# EAGLE design usbhub (EAGLE 7.5.0)
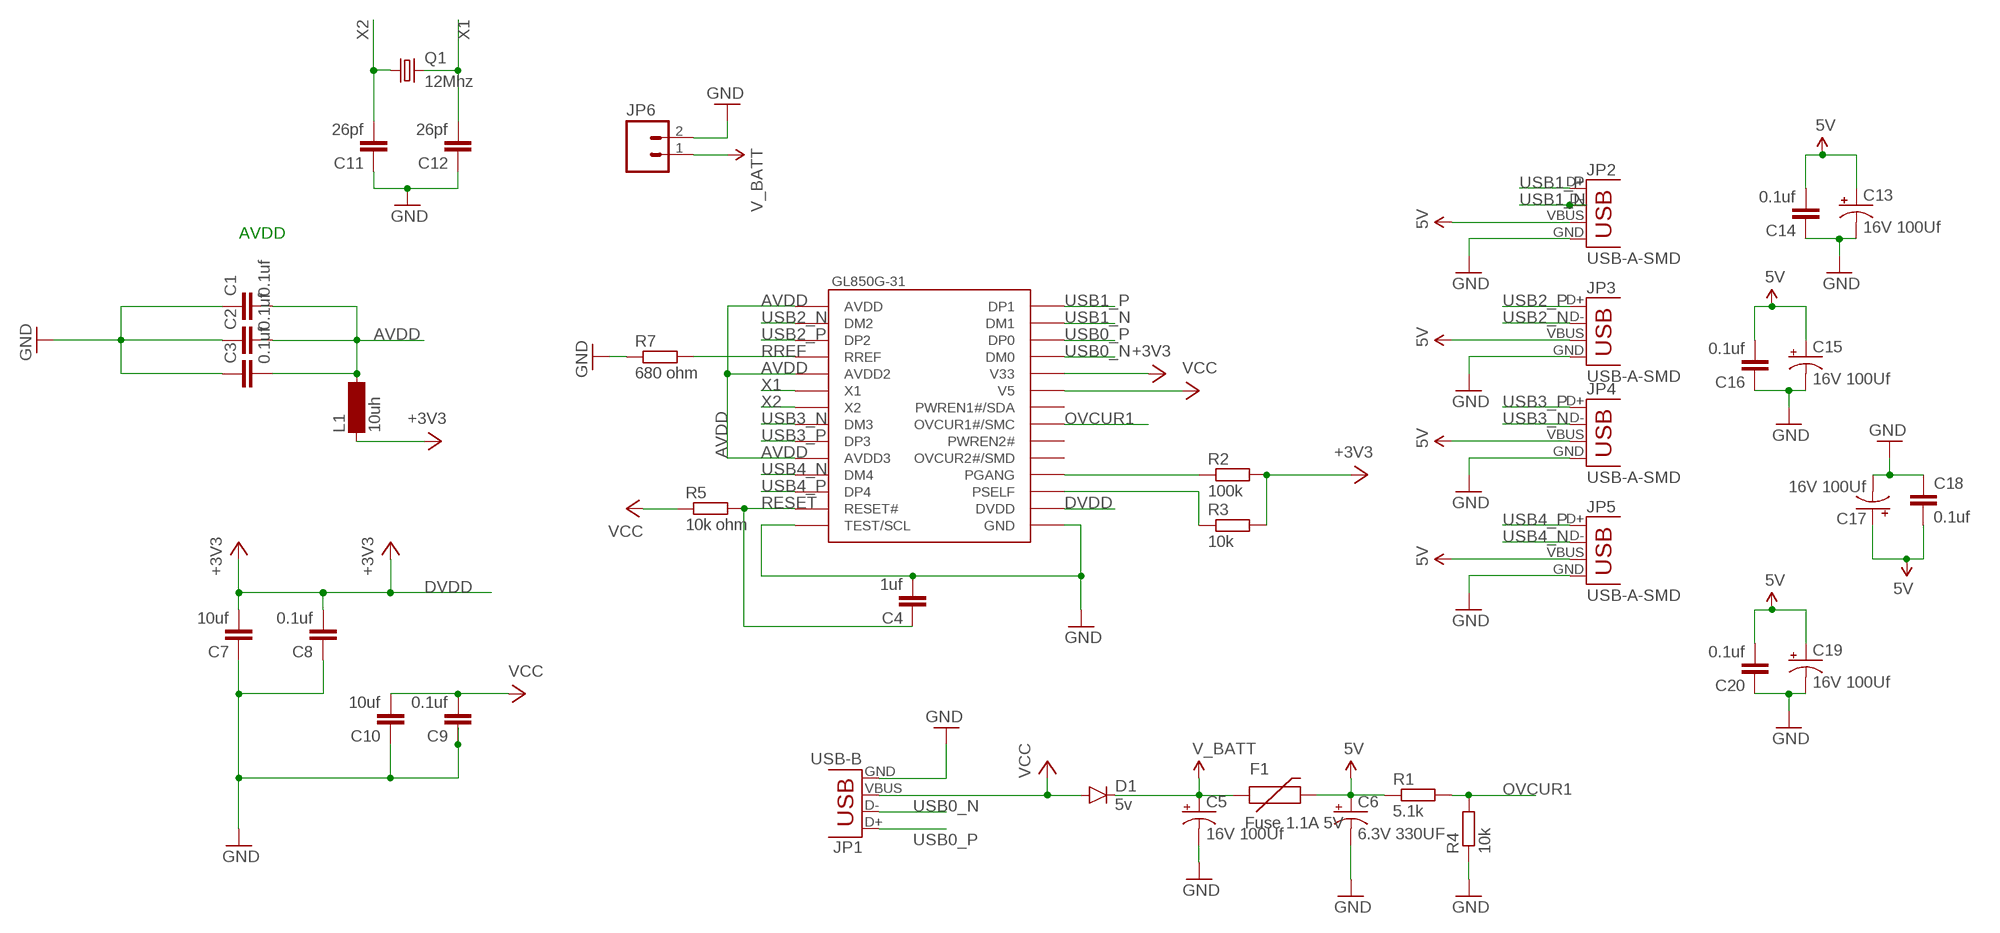
[diagram p0: schematic, sheet 1]

## Parts
C1  0.1uf  C-EUC1206  [C1206]
C2  0.1uf  C-EUC1206  [C1206]
C3  0.1uf  C-EUC1206  [C1206]
C4  1uf  C-EUC1206  [C1206]
C5  16V 100Uf  CAP_POLD  [PANASONIC_D]
C6  6.3V 330UF  CAP_POLD  [PANASONIC_D]
C7  10uf  C-EUC1206  [C1206]
C8  0.1uf  C-EUC1206  [C1206]
C9  0.1uf  C-EUC1206  [C1206]
C10  10uf  C-EUC1206  [C1206]
C11  26pf  C-EUC1206  [C1206]
C12  26pf  C-EUC1206  [C1206]
C13  16V 100Uf  CAP_POLD  [PANASONIC_D]
C14  0.1uf  C-EUC1206  [C1206]
C15  16V 100Uf  CAP_POLD  [PANASONIC_D]
C16  0.1uf  C-EUC1206  [C1206]
C17  16V 100Uf  CAP_POLD  [PANASONIC_D]
C18  0.1uf  C-EUC1206  [C1206]
C19  16V 100Uf  CAP_POLD  [PANASONIC_D]
C20  0.1uf  C-EUC1206  [C1206]
D1  5v  DIODESMA-ALT  [SMA-DIODE_ALT]
F1  Fuse 1.1A 5V  PTCSMD  [PTC-1206]
JP1  USB-B  USBPTH  [USB-B-PTH]
JP2  USB-A-SMD  [USB-A-S-NOSILK-FEMALE]
JP3  USB-A-SMD  [USB-A-S-NOSILK-FEMALE]
JP4  USB-A-SMD  [USB-A-S-NOSILK-FEMALE]
JP5  USB-A-SMD  [USB-A-S-NOSILK-FEMALE]
JP6  M02LOCK_LONGPADS  [1X02_LOCK_LONGPADS]
L1  10uh  SM-1206  [SM-1206]
Q1  12Mhz  CRYSTALCTS406  [CTS406]
R1  5.1k  R-EU_M1206  [M1206]
R2  100k  R-EU_M1206  [M1206]
R3  10k  R-EU_M1206  [M1206]
R4  10k  R-EU_M1206  [M1206]
R5  10k ohm  R-EU_M1206  [M1206]
R7  680 ohm  R-EU_M1206  [M1206]
U$1  GL850G-31  [TSSOP28]

## Nets
5V: C6.+ C13.+ C14.2 C15.+ C16.2 C17.+ C18.2 C19.+ C20.2 F1.2 JP2.VBUS JP3.VBUS JP4.VBUS JP5.VBUS R1.1
+3V3: L1.1 R2.2 R3.2 U$1.24(V33)
AVDD: C1.2 C2.2 C3.2 L1.2 U$1.1(AVDD) U$1.5(AVDD2) U$1.10(AVDD3)
DVDD: C7.2 C8.2 U$1.16(DVDD) ; supply symbol labelled +3V3
GND: C1.1 C2.1 C3.1 C4.2 C5.- C6.- C7.1 C8.1 C9.1 C10.1 C11.1 C12.1 C13.- C14.1 C15.- C16.1 C17.- C18.1 C19.- C20.1 JP1.GND JP2.GND JP3.GND JP4.GND JP5.GND JP6.2 R4.1 R7.1 U$1.14(TEST/SCL) U$1.15(GND)
N$2: R2.1 U$1.18(PGANG)
N$4: R3.1 U$1.17(PSELF)
OVCUR1: R1.2 R4.2 U$1.21(OVCUR1#/SMC)
RESET: C4.1 R5.2 U$1.13(RESET#)
RREF: R7.2 U$1.4(RREF)
USB0_N: JP1.D- U$1.25(DM0)
USB0_P: JP1.D+ U$1.26(DP0)
USB1_N: JP2.D- U$1.27(DM1)
USB1_P: JP2.D+ U$1.28(DP1)
USB2_N: JP3.D- U$1.2(DM2)
USB2_P: JP3.D+ U$1.3(DP2)
USB3_N: JP4.D- U$1.8(DM3)
USB3_P: JP4.D+ U$1.9(DP3)
USB4_N: JP5.D- U$1.11(DM4)
USB4_P: JP5.D+ U$1.12(DP4)
V_BATT: C5.+ D1.C F1.1 JP6.1
VCC: C9.2 C10.2 D1.A JP1.VBUS R5.1 U$1.23(V5)
X1: C12.2 Q1.3 U$1.6(X1)
X2: C11.2 Q1.1 U$1.7(X2)
Unconnected: U$1.19(OVCUR2#/SMD) U$1.20(PWREN2#) U$1.22(PWREN1#/SDA)

## Notes on the sheet
- AVDD

## Library data of the parts
C1-C3 C8 C9 C14 C16 C18 C20 = rcl:C-EU: CAPACITOR, European symbol; MF: MULTICOMP; MPN: MCSH31B104K500CT; OC_FARNELL: 1856626
C4 = rcl:C-EU: CAPACITOR, European symbol; MF: AVX; MPN: 12061C105KAT2A; OC_FARNELL: 1657939
C5 C13 C15 C17 C19 = SparkFun-Passives:CAP_POL: Capacitor Polarized These are standard SMD and PTH capacitors. Normally 10uF, 47uF, and 100uF in electrolytic and tantalum varieties. Always verify the external diameter of the through hole cap, it varies with capacity, voltage, and manufacturer. The EIA devices should be standard.; MF: PANASONIC ELECTRONIC COMPONENTS; MPN: EEEHA1C101WP; OC_FARNELL: 1973308
C6 = SparkFun-Passives:CAP_POL: Capacitor Polarized These are standard SMD and PTH capacitors. Normally 10uF, 47uF, and 100uF in electrolytic and tantalum varieties. Always verify the external diameter of the through hole cap, it varies with capacity, voltage, and manufacturer. The EIA devices should be standard.; MF: PANASONIC ELECTRONIC COMPONENTS; MPN: EEEHC0J331P; OC_FARNELL: 1714688
C7 C10 = rcl:C-EU: CAPACITOR, European symbol; MF: KEMET; MPN: C1206C106K3PACTU; OC_FARNELL: 1288206
C11 C12 = rcl:C-EU: CAPACITOR, European symbol; MF: AVX; MPN: 12061A220JAT2A; OC_FARNELL: 499249
D1 = SparkFun-DiscreteSemi:DIODE: Diode These are standard reverse protection diodes and small signal diodes. SMA package can handle up to about 1A. SOD-323 can handle about 200mA. What the SOD-323 package when ordering, there are some mfgs out there that are 5-pin packages.; MF: LITTELFUSE; MPN: SMAJ5.0A; OC_FARNELL: 1827607
F1 = SparkFun-PowerIC:PTC: Resettable Fuse PTC Resettable Fuse. Spark Fun Electronics SKU : COM-08357; MF: TE CONNECTIVITY / RAYCHEM; MPN: MICROSMD110F-2; OC_FARNELL: 1345920; PROD_ID: RES-11150
JP1 = SparkFun-Connectors:USB: USB Connectors USB-B-PTH is fully proven SKU : PRT-00139/CONN-08278 USB-miniB is fully proven SKU : PRT-00587 USB-A-PCB is untested. USB-A-H is throughly reviewed, but untested. Spark Fun Electronics SKU : PRT-00437 USB-B-SMT is throughly reviewed, but untested. Needs silkscreen touching up. USB-A-S has not been used/tested USB-MB-H has not been used/tested USB-MICROB has been used. CONN-09505; MF: TE CONNECTIVITY / AMP; MPN: 292304-1; OC_FARNELL: 1076665; PROD_ID: CONN-08278
JP2-JP5 = SparkFun-Connectors:USB: USB Connectors USB-B-PTH is fully proven SKU : PRT-00139/CONN-08278 USB-miniB is fully proven SKU : PRT-00587 USB-A-PCB is untested. USB-A-H is throughly reviewed, but untested. Spark Fun Electronics SKU : PRT-00437 USB-B-SMT is throughly reviewed, but untested. Needs silkscreen touching up. USB-A-S has not been used/tested USB-MB-H has not been used/tested USB-MICROB has been used. CONN-09505; OC_FARNELL: unknown; PROD_ID: CONN-09520
JP6 = SparkFun-Connectors:M02: Standard 2-pin 0.1" header. Use with - straight break away headers ( PRT-00116) - right angle break away headers (PRT-00553) - swiss pins (PRT-00743) - machine pins (PRT-00117) - female headers (PRT-00115) Molex polarized connector foot print use with: PRT-08233 with associated crimp pins and housings. 2.54_SCREWTERM for use with PRT-10571. 3.5mm Screw Terminal footprints for PRT-08084 5mm Screw Terminal footprints for use with PRT-08432; OC_FARNELL: unknown
L1 = inductor-neosid:SM-1206: INDUCTOR SMD chip inductor; MF: COILCRAFT; MPN: PFL3215-103MEB; OC_FARNELL: 2288772; OC_NEWARK: unknown
Q1 = crystal:CRYSTAL: CRYSTAL; MF: ABRACON; MPN: ABM3B-12.000MHZ-B2-T; OC_FARNELL: 1611810; OC_NEWARK: unknown
R1 = rcl:R-EU_: RESISTOR, European symbol; MF: VISHAY; MPN: CRCW12065K10FKEA.; OC_FARNELL: 2139485
R2 = rcl:R-EU_: RESISTOR, European symbol; MF: WELWYN; MPN: WCR1206-100KFI; OC_FARNELL: 1100244
R3-R5 = rcl:R-EU_: RESISTOR, European symbol; MF: MULTICOMP; MPN: MCMR12X1002FTL; OC_FARNELL: 2073878
R7 = rcl:R-EU_: RESISTOR, European symbol; MF: WELWYN; MPN: WCR1206-680RFI; OC_FARNELL: 1100187
U$1 = pimoroni:GL850G-31; OC_FARNELL: unknown

## Board
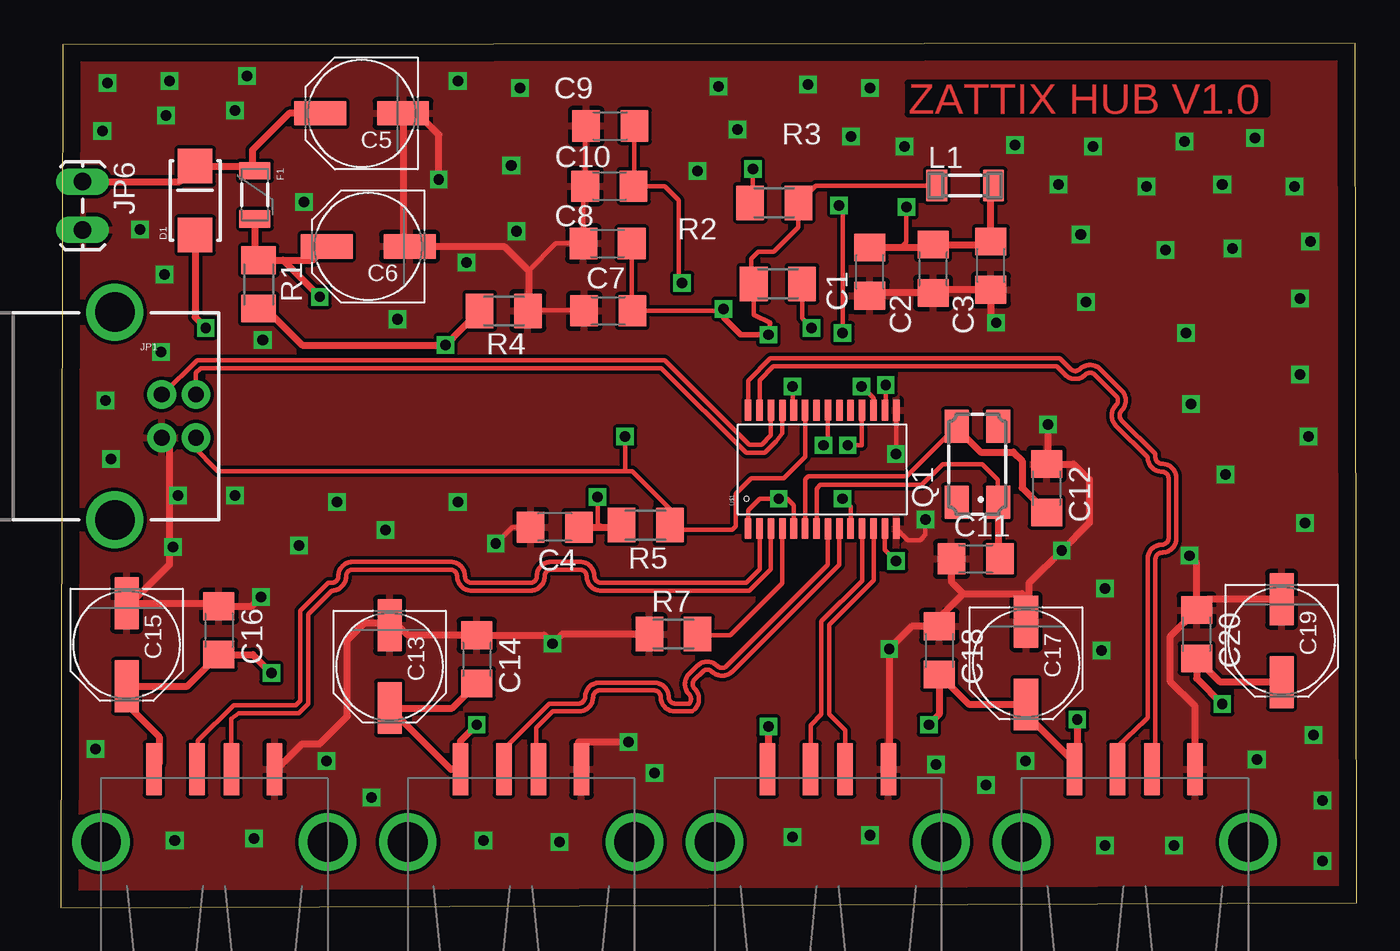
[diagram p1: board, top side]
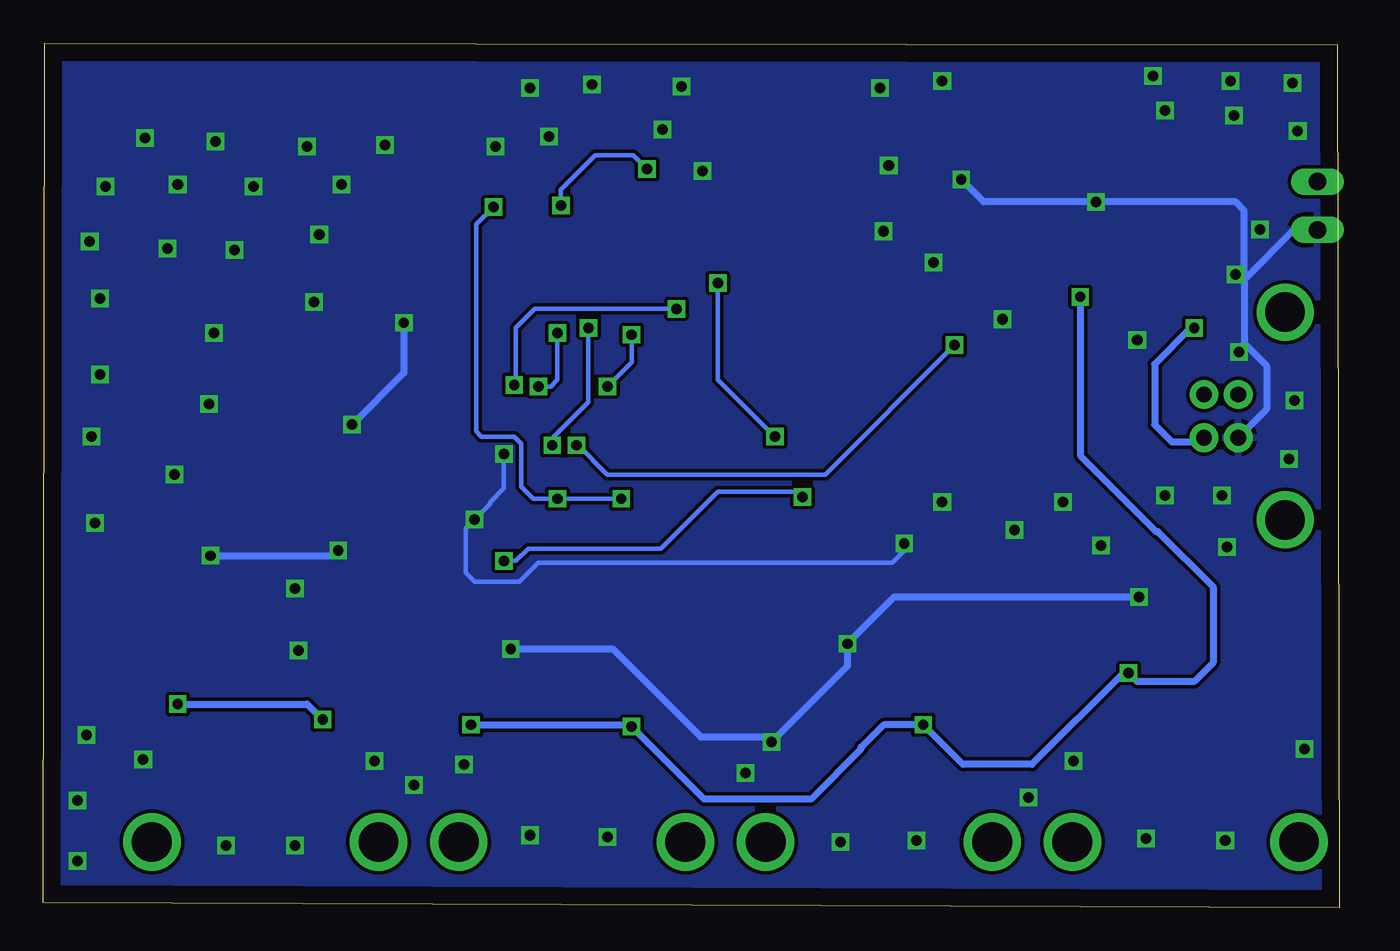
[diagram p2: board, bottom side, seen from below]

Size 75.1 x 50.1 mm. Coordinates in mm from the lower left corner, seen from the top.
Outline: 0,0 75.1,0.3 75,50.1 0.1,50 0,0
Copper layers (1*16): Top 0.035mm / dielectric 1.5mm / Bottom 0.035mm
Design rules "default": minimum track width 10mil, minimum drill 24mil, track to track 8mil, track to pad 8mil, pad to pad 8mil, via to via 8mil, smd to smd 8mil, copper to edge 40mil, drill to drill 8mil, minimum pad ring 10mil, minimum via ring 8mil, stop-mask expansion 4mil, vias tented up to drill 0mil, thermal gap 10mil

### Footprints (pad centres in the part's own frame; a part is rotated, then mirrored left to right if it is on the bottom)
C1206 = smd 1.6 x 1.8: 1 -1.4,0; 2 1.4,0
PANASONIC_D = smd 3 x 1.4: + 2.4,0; - -2.4,0
SMA-DIODE_ALT = smd 2 x 2: A -2,0; C 2,0
PTC-1206 = smd 1 x 1.8: 1 -1.4,0; 2 1.4,0
USB-B-PTH = drill 0.914 pad 1.676: D+ 0,1.25; D- 1.981,1.25; GND 0,-1.25; VBUS 1.981,-1.25 | drill 2.286: S1 -2.718,-6.02; S2 -2.718,6.02
USB-A-S-NOSILK-FEMALE = smd 3 x 0.9: D+ 4.212,-1; D- 4.212,1; GND 4.212,-3.5; VBUS 4.212,3.5 | drill 2.311: S1 0,-6.566; S2 0,6.566
1X02_LOCK_LONGPADS = drill 1.016 long: 1 -0.127,0; 2 2.667,0
SM-1206 = smd 1.2 x 1.8: 1 -1.65,0; 2 1.65,0
CTS406 = smd 1.9 x 1.4: 1 -2.2,-1.2; 2 2.2,-1.2; 3 2.2,1.2; 4 -2.2,1.2
M1206 = smd 1.6 x 2: 1 -1.4,0; 2 1.4,0
TSSOP28 = smd 1.2 x 0.38: 1 -3.429,4.623; 2 -3.429,3.962; 3 -3.429,3.302; 4 -3.429,2.642; 5 -3.429,1.981; 6 -3.429,1.321; 7 -3.429,0.66; 8 -3.435,0; 9 -3.429,-0.66; 10 -3.429,-1.321; 11 -3.429,-1.981; 12 -3.429,-2.642; 13 -3.429,-3.302; 14 -3.429,-3.962; 15 3.429,-3.962; 16 3.429,-3.302; 17 3.429,-2.642; 18 3.429,-1.981; 19 3.429,-1.321; 20 3.429,-0.66; 21 3.435,0; 22 3.429,0.66; 23 3.429,1.321; 24 3.429,1.981; 25 3.429,2.642; 26 3.429,3.302; 27 3.429,3.962; 28 3.429,4.623

### Placement (x,y rotation side)
C1  46.88,36.86 90 top
C2  50.55,37.03 90 top
C3  53.89,37.21 90 top
C4  28.62,22.06 180 top
C5  17.43,46.03 180 top
C6  17.81,38.32 180 top
C7  31.72,34.59 0 top
C8  31.68,38.49 0 top
C9  31.84,45.3 0 top
C10  31.79,41.82 0 top
C11  53.01,20.22 0 top
C12  57.12,24.31 270 top
C13  19.05,13.97 270 top
C14  24.1,14.39 270 top
C15  3.81,15.24 270 top
C16  9.16,16.07 270 top
C17  55.93,14.17 270 top
C18  50.9,14.91 270 top
C19  70.74,15.47 270 top
C20  65.81,15.85 270 top
D1  7.78,40.98 90 top
F1  11.24,41.31 270 top
JP1  5.85,28.49 0 top
JP2  62.23,3.81 90 top
JP3  8.89,3.81 90 top
JP4  26.67,3.81 90 top
JP5  44.45,3.81 90 top
JP6  1.26,41.95 270 top
L1  52.4,41.85 0 top
Q1  53.11,25.7 90 top
R1  11.46,36.12 270 top
R2  41.55,36.15 180 top
R3  41.34,40.84 0 top
R4  25.67,34.58 180 top
R5  33.89,22.17 180 top
R7  35.5,15.86 0 top
U$1  44.45,25.4 90 top

### Tracks (layer width: path | path; a pad name or v marks a point on that pad's centre or on a via)
5V  (via drill 0.6)
  Top 0.406: C17.+ 55.4,11.77 | 55.4,11.77 52.64,11.77 C18.2 50.9,11.2 v50.3,10.6 | C19.+ 67.19,13.07 C20.2 65.81,13.29 v67.3,11.8 | v58.9,10.9 58.9,8.19 JP2.VBUS 58.73,8.44 55.4,11.77 | C14.2 22.68,11.57 C13.+ 22.6,8.02 JP4.VBUS 23.17,9.67 v24.1,10.6 | v41,10.5 41,8.07 JP5.VBUS | JP3.VBUS 5.7,8.33 5.7,9.9 3.81,11.79 C15.+ 7.33,12.84 C16.2 11.13,14.67 v12.2,13.6 | F1.2 11.24,37.74 R1.1 | R1.1 14.61,37.52 C6.+ | R1.1 12.88,37.52 v15,35.4
  Bottom 0.406: v67.3,11.8 59.8,11.8 v58.9,10.9 | v50.3,10.6 41.1,10.6 v41,10.5 36.8,6.3 30.6,6.3 27.7,9.2 27.7,9.3 26.4,10.6 v24.1,10.6 21.8,8.3 17.8,8.3 12.5,13.6 v12.2,13.6 11.7,13.1 8.4,13.1 7.3,14.2 7.3,18.6 10.5,21.8 10.6,21.8 15,26.2 v15,35.4
+3V3  (via drill 0.6)
  Top 0.254: L1.1 43.75,41.85 R3.2 42.74,39.44 41.3,38 40.4,38 40,37.6 40,36.3 R2.2 40.15,34.35 41.1,33.9 v41,33.2 | v42.4,30.2 42.4,28.9 U$1.24
  Bottom 0.254: v41,33.2 41,31.6 v42.4,30.2
AVDD  (via drill 0.6)
  Top 0.254: U$1.1 39.83,23.03 40.5,23.7 v41.6,23.7 42.1,23.7 42.47,23.33 U$1.5 | U$1.10 45.77,23.23 v45.3,23.7 | v49,40.6 49,38.56 48.7,38.26
  Top 0.406: C1.2 48.7,38.26 50.38,38.26 C2.2 53.71,38.43 C3.2 53.89,41.69 L1.2
  Bottom 0.254: v41.6,23.7 v45.3,23.7 46.7,23.7 47.4,24.4 47.4,26.9 47.8,27.3 49.7,27.3 50,27.6 50,39.6 v49,40.6
DVDD  (via drill 0.6)
  Top 0.254: v38.4,34.7 38.29,34.59 C7.2 33.08,34.63 C8.2 | v47.8,30.3 47.8,28.88 U$1.16
  Top 0.305: v38.4,34.7 38.4,34.2 39.4,33.2 41.1,33.2
  Bottom 0.254: v38.4,34.7 46.6,34.7 47.7,33.6 47.7,30.4 v47.8,30.3
GND  (via drill 0.6, 0.61)
  Top 0.254: 27.1,34.61 30.3,34.61 C7.1 | 27.1,36.9 28.69,38.49 C8.1 30.28,41.71 C10.1 30.39,45.25 C9.1 | U$1.15 48.41,26.31 v48.4,26.3 | v50.1,22.5 50.1,21.6 49.8,21.3 49.08,21.3 U$1.14 | C4.2 26.16,22.06 v25.2,21.1
  Top 0.406: 56.1,17.8 56.1,18.8 v58,20.7 59.6,22.3 59.6,24.8 58.69,25.71 C12.1 57.2,25.79 v57.2,28 | 56.1,17.8 56.1,16.74 C17.- | C11.1 51.61,18.89 52.3,18.2 | 52.3,18.2 55.7,18.2 56.1,17.8 | 52.3,18.2 50.9,16.8 C18.1 49.31,16.31 v48,15 48,8.07 JP5.GND | C19.- 66.43,17.87 C20.1 | JP2.GND 65.73,11.67 64.3,13.1 64.3,15.74 C20.1 | v32.9,9.6 30,9.6 30,8.19 JP4.GND | JP3.GND 12.52,8.02 14,9.5 15,9.5 16.6,11.1 16.6,15.5 17.6,16.5 18.5,16.5 19.2,15.8 19.2,16.22 C13.- 19,16.42 19,16.9 20.11,15.79 C14.1 28.01,15.79 v28.5,15.3 29.06,15.86 | v11.6,18 11.07,17.47 C16.1 8.99,17.64 C15.- 4.04,17.64 6.3,19.9 6.3,26.79 JP1.GND | R4.1 27.1,34.61 27.1,36.9 25.68,38.32 C6.- 19.83,38.7 C5.- 20.16,45.7 21,45.7 21.9,44.8 v21.9,42.2 | C20.1 65.81,19.99 v65.4,20.4 | 29.06,15.86 R7.1 29.06,15.86 | C1.1 47.05,35.63 C2.1 50.73,35.81 C3.1 53.89,34.21 v54.2,33.9
  Bottom 0.254: v48.4,26.3 48.4,24.3 49.2,23.5 49.2,23.4 v50.1,22.5 50.6,22 50.6,19.4 50.1,18.9 47.5,18.9 46.4,20 25.9,20 25.2,20.7 v25.2,21.1
  Bottom 0.406: v11.6,18 25.8,18 v28.5,15.3 28.5,14 v32.9,9.6 33.2,9.9 37,9.9 42.1,15 v48,15 | JP6.2 2.62,39.28 5.5,36.4 | 5.5,36.4 5.5,32.7 4.2,31.4 4.2,28.89 JP1.GND | 5.5,36.4 5.5,40.4 6,40.9 20.6,40.9 v21.9,42.2 | v65.4,20.4 58.3,20.4 v58,20.7 | v54.2,33.9 54.2,31 v57.2,28
  other vias: 2,9.2 6.6,3.9 11.2,4 15.4,8.5 18,6.4 24.5,3.9 28.9,3.8 34.4,7.8 42.4,4.1 46.9,4.2 50.7,8.3 53.6,7.1 55.9,8.5 60.5,3.6 64.5,3.6 73.1,2.7 73.1,6.2 69.3,8.6 72.6,10 60.3,14.9 60.5,18.5 72.1,22.3 67.5,25.1 72.3,27.3 65.5,29.2 71.8,30.9 65.2,33.3 59.4,35.1 67.9,38.2 71.8,35.3 64,38.1 59.1,39 57.8,41.9 62.9,41.8 67.3,41.9 71.5,41.8 72.4,38.6 69.2,44.6 65.1,44.4 59.8,44.1 55.3,44.2 48.9,44.1 46.9,47.5 45.8,44.7 43.3,47.7 39.2,45.1 38.1,47.6 36.9,42.7 26.6,47.5 26.1,43 23,47.9 26.4,39.2 23.5,37.4 19.5,34.1 23,23.5 18.8,21.9 16,23.5 13.8,21 6.5,20.9 10.1,23.9 6.8,23.9 2.9,26 2.6,29.4 5.8,32.2 11.7,32.9 6,36.7 4.6,39.3 14.1,40.9 10.1,46.2 6.1,45.9 2.4,45 2.7,47.8 6.3,47.9 10.8,48.2
  pour Bottom: -0.2,50.2 -0.2,0 75.1,0 75.1,0.3 75,0.3 75,50.4 -0.2,50.4
  pour Top: 0,49.7 -0.1,49.7 -0.1,-0.3 75.2,-0.3 75.2,-0.1 75.3,-0.1 75.3,50.2 -0.3,50.2 -0.3,49.8
N$2  (via drill 0.6)
  Top 0.254: R2.1 42.95,34.15 v43.5,33.6 | v45.6,26.8 46.4,26.8 46.4,28.8 U$1.18
  Bottom 0.254: v43.5,33.6 43.5,29.3 45.5,27.3 45.5,26.9 v45.6,26.8
N$4  (via drill 0.6)
  Top 0.254: U$1.17 47.09,29.51 v46.4,30.2 | v45.3,33.3 45.3,40.5 v45.1,40.7 | v40.1,42.8 40.1,41 R3.1
  Bottom 0.254: v46.4,30.2 45.7,30.2 45.3,30.6 v45.3,33.3 | v45.1,40.7 45.1,41.6 43.1,43.6 40.9,43.6 v40.1,42.8
OVCUR1  (via drill 0.6)
  Top 0.254: U$1.21 44.45,27.05 v44.2,26.8
  Top 0.406: R1.2 11.88,34.72 14,32.6 v22.29,32.6 23.25,33.55 R4.2
  Bottom 0.254: v44.2,26.8 44.1,26.8 42.4,25.1 29.79,25.1 v22.29,32.6
RESET  (via drill 0.6)
  Top 0.254: U$1.13 47.75,20.75 v48.4,20.1 | v31.1,23.8 31.1,22.26 31.3,22.06
  Top 0.406: C4.1 31.3,22.06 32.38,22.06 R5.2
  Bottom 0.254: v48.4,20.1 47.7,20.1 47,20.8 39.3,20.8 36,24.1 31.4,24.1 v31.1,23.8
RREF
  Top 0.254: U$1.4 41.81,18.81 38.8,15.8 36.96,15.8 R7.2
USB0_N
  Top 0.254: JP1.D- 7.83,31.01 8.1,31.27 34.8,31.27 39.7,26.37 40.8,26.37 41.46,27.04 41.81,27.48 U$1.25
USB0_P
  Top 0.254: JP1.D+ 5.92,29.74 7.91,31.73 34.99,31.73 39.9,26.83 40.6,26.83 41.15,27.37 U$1.26
USB1_N
  Top 0.254: U$1.27 40.49,30.56 41.3,31.37 57.7,31.37 58.19,30.89 arc90 59.37,30.89 arc-90 59.91,30.89 61.14,29.66 arc-90 61.14,29.12 arc90 61.14,27.94 62.97,26.11 arc90 63.81,25.27 arc-90 64.19,24.89 64.19,21.42 arc-90 63.81,21.04 arc90 62.97,20.2 62.97,10.99 62.84,10.86 61.23,9.35 JP2.D-
USB1_P
  Top 0.254: U$1.28 39.83,30.55 41.1,31.83 57.9,31.83 58.51,31.21 arc90 59.05,31.21 arc-90 60.24,31.21 61.46,29.99 arc-90 61.46,28.8 arc90 61.46,28.26 63.43,26.3 63.43,26.11 arc90 63.81,25.72 arc-90 64.65,24.89 64.65,21.42 arc-90 63.81,20.58 arc90 63.43,20.2 63.43,8.22 JP2.D+
USB2_N
  Top 0.254: U$1.2 40.49,19.61 39.7,18.83 31.3,18.83 arc-90 30.92,19.21 arc90 30.08,20.05 28.42,20.05 arc90 27.58,19.21 arc-90 27.2,18.83 23.8,18.83 arc-90 23.42,19.21 arc90 22.58,20.05 16.91,20.05 arc90 16.08,19.21 arc-90 15.7,18.83 15.51,18.83 13.87,17.2 13.87,11.99 13.61,11.73 10.01,11.73 7.94,9.66 7.94,8.07 JP3.D-
USB2_P
  Top 0.254: U$1.3 41.15,19.62 39.9,18.37 31.3,18.37 arc-90 30.46,19.21 arc90 30.08,19.59 28.42,19.59 arc90 28.04,19.21 arc-90 27.2,18.37 23.8,18.37 arc-90 22.96,19.21 arc90 22.58,19.59 16.91,19.59 arc90 16.53,19.21 arc-90 15.7,18.37 14.33,17 14.33,11.8 13.79,11.27 10.29,11.27 9.86,10.94 9.86,8.05 JP3.D+
USB3_N
  Top 0.254: U$1.8 44.45,19.87 38.59,14.01 arc-90 38.05,14.01 arc90 36.86,14.01 36.41,13.55 arc90 36.41,12.37 arc-90 36.41,11.83 35.6,11.83 arc-90 35.22,12.21 arc90 34.38,13.05 31.22,13.05 arc90 30.38,12.21 arc-90 30,11.83 28.3,11.83 25.84,9.36 25.67,9.36 JP4.D- 25.84,8.19
USB3_P
  Top 0.254: U$1.9 45.11,19.89 38.91,13.69 arc-90 37.73,13.69 arc90 37.19,13.69 36.73,13.23 arc90 36.73,12.69 arc-90 36.73,11.51 36.59,11.37 35.6,11.37 arc-90 34.76,12.21 arc90 34.38,12.59 31.22,12.59 arc90 30.84,12.21 arc-90 30,11.37 28.5,11.37 27.56,10.44 27.56,8.13 JP4.D+
USB4_N
  Top 0.254: U$1.11 46.43,18.95 44.07,16.59 44.07,11.2 43.45,10.58 JP5.D-
USB4_P
  Top 0.254: U$1.12 47.09,18.97 44.53,16.41 44.53,11.2 45.45,10.28 JP5.D+
V_BATT
  Top 0.406: JP6.1 6.88,42.08 D1.C 10.97,42.98 F1.1 11.1,42.85 11.1,43.9 13.23,46.03 C5.+
VCC  (via drill 0.6)
  Top 0.254: U$1.23 43.13,26.13 41.9,24.9 40,24.9 39.1,24 39.1,22.1 38.9,21.9 35.56,21.9 R5.1 35.29,23.11 33.1,25.3 32.7,25.3 | 32.7,25.3 9.1,25.3 7.6,26.8 7.6,27.01 JP1.VBUS | C9.2 33.24,41.87 C10.2 34.98,41.82 35.8,41 35.8,36.4 v36,36.2 | v32.7,27.3 32.7,25.3
  Top 0.406: D1.A 7.78,34.22 v8.4,33.6
  Bottom 0.254: v36,36.2 36,30.6 v32.7,27.3
  Bottom 0.406: v8.4,33.6 8.6,33.6 10.7,31.5 10.7,28 9.7,27 8.07,27 JP1.VBUS
X1
  Top 0.254: U$1.6 43.13,24.83 43.3,25 49.01,25 Q1.3
  Top 0.406: Q1.3 51.91,27.79 53.3,26.4 55.2,26.4 55.7,25.9 55.7,24.33 C12.2
X2
  Top 0.254: U$1.7 43.79,24.29 44,24.5 49.9,24.5 51.1,25.7 53.4,25.7 54.3,24.8 Q1.1
  Top 0.406: Q1.1 54.31,20.32 C11.2

### Text on the board
Top: ZATTIX HUB V1.0